# EAGLE design master_brandon (EAGLE 7.1.0)
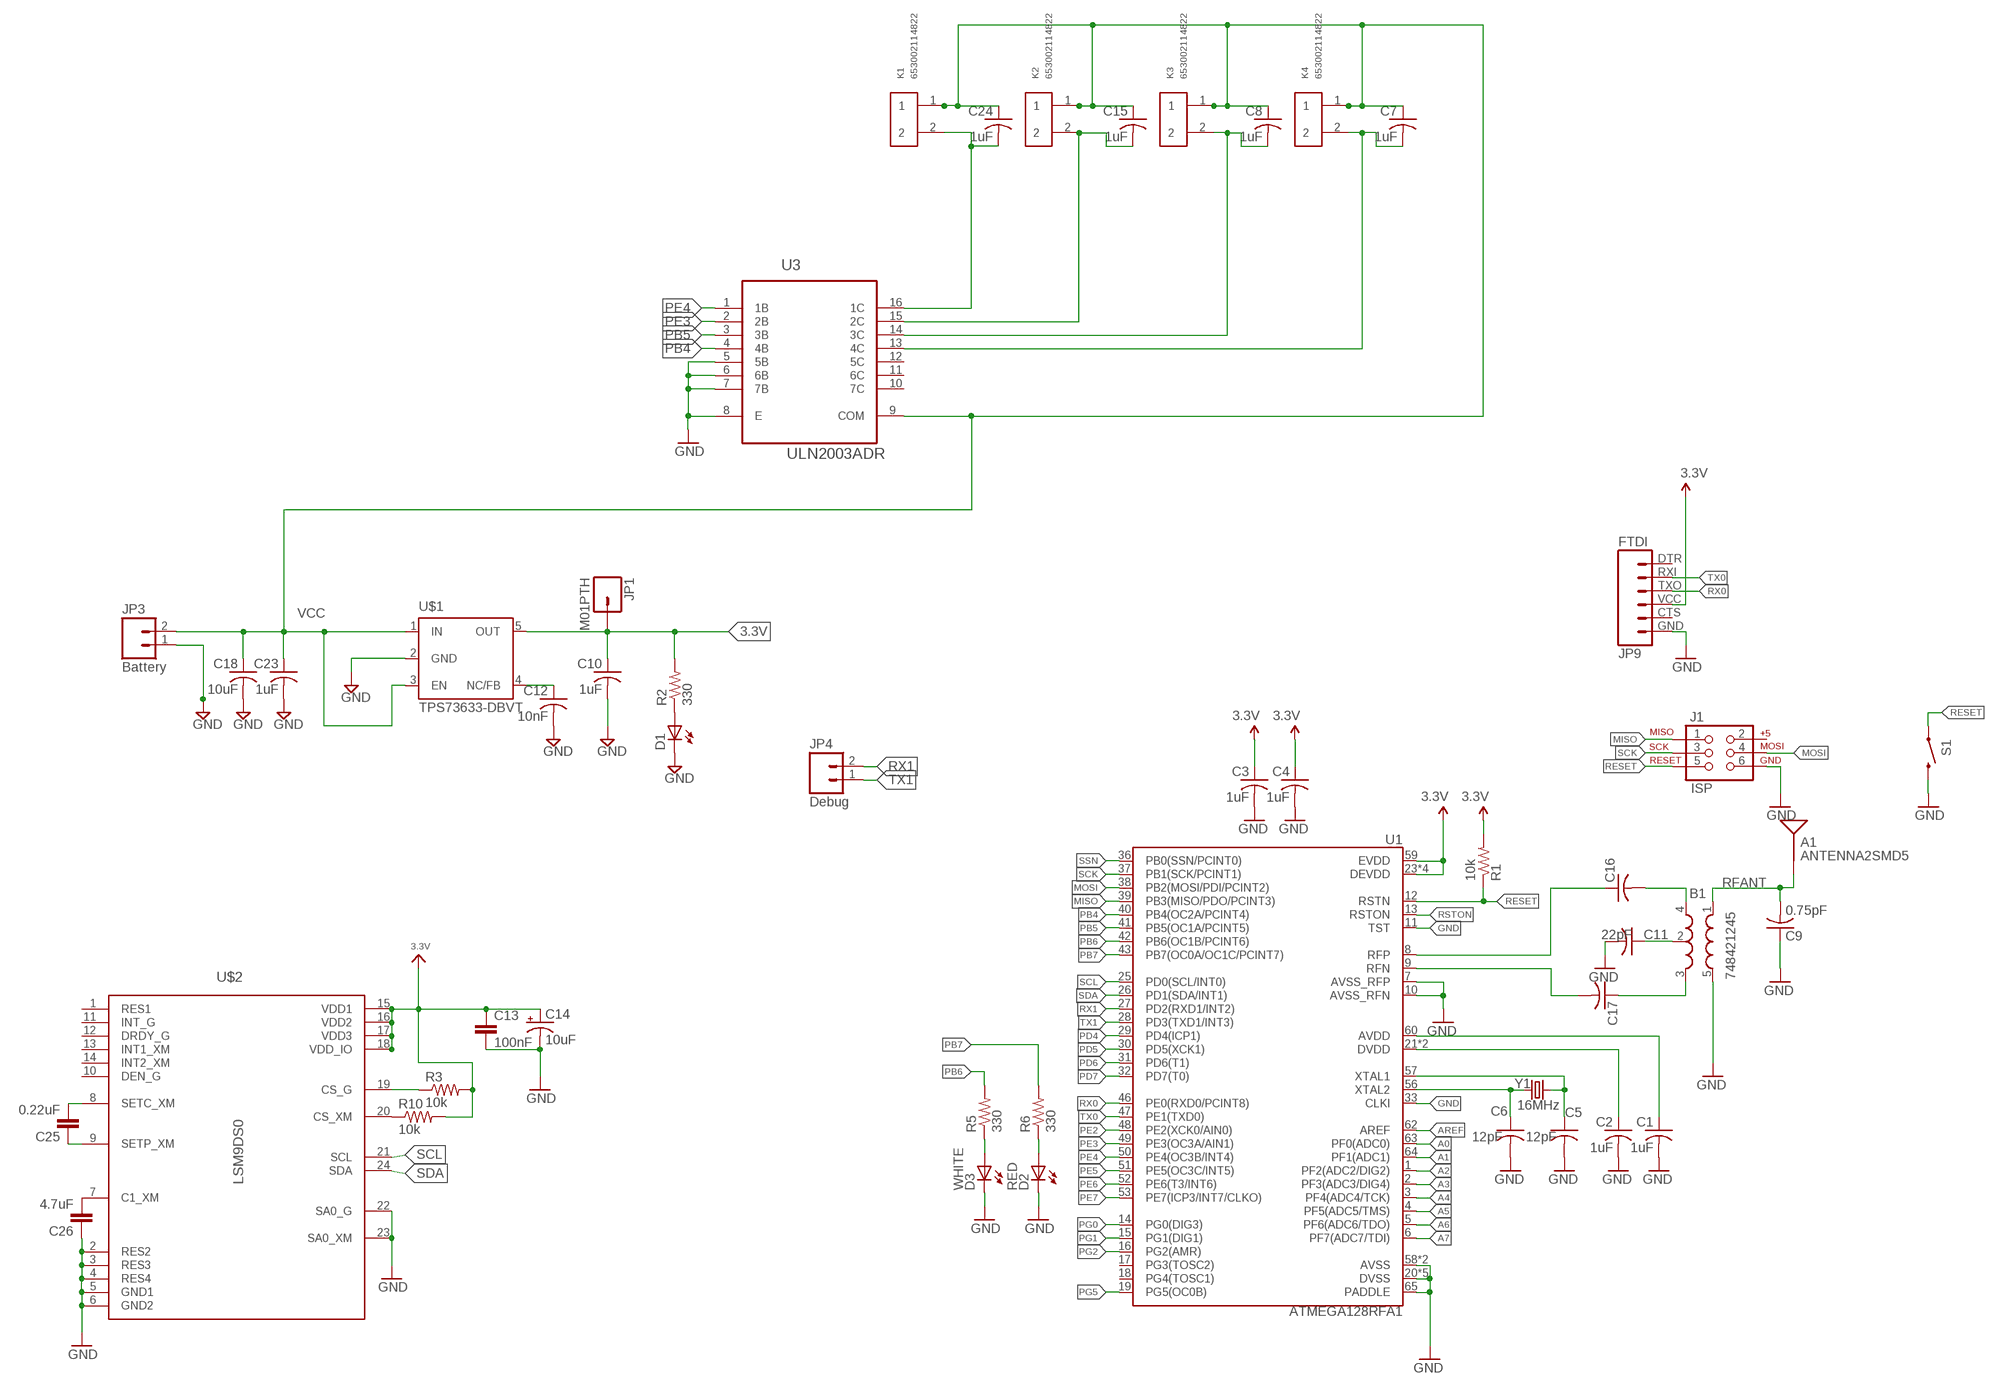
[diagram p0: schematic, sheet 1]

## Parts
A1  ANTENNA2SMD5  [ANTENNA-CHIP5]
B1  748421245  BALUN0805  [BALUN]
C1  1uF  C-USC0805  [C0805]
C2  1uF  C-USC0805  [C0805]
C3  1uF  C-USC0805  [C0805]
C4  1uF  C-USC0805  [C0805]
C5  12pF  C-USC0805  [C0805]
C6  12pF  C-USC0805  [C0805]
C7  1uF  C-USC0805  [C0805]
C8  1uF  C-USC0805  [C0805]
C9  0.75pF  C-USC0805  [C0805]
C10  1uF  C-USC0805  [C0805]
C11  22pF  C-USC0805  [C0805]
C12  10nF  C-USC0805  [C0805]
C13  100nF  CAP0603-CAP  [0603-CAP]
C14  10uF  10UF-20V-10%(TANT)  [EIA3528]
C15  1uF  C-USC0805  [C0805]
C16  C-USC0805  [C0805]
C17  C-USC0805  [C0805]
C18  10uF  C-USC0805  [C0805]
C23  1uF  C-USC0805  [C0805]
C24  1uF  C-USC0805  [C0805]
C25  0.22uF  CAP0603-CAP  [0603-CAP]
C26  4.7uF  CAP0603-CAP  [0603-CAP]
D1  LEDSML0603  [SML0603]
D2  RED  LEDCHIPLED_0603  [CHIPLED_0603]
D3  WHITE  LEDCHIPLED_0603  [CHIPLED_0603]
J1  ISP  AVR_SPI_PRG_6NS  [2X3-NS]
JP1  M01PTH  [1X01]
JP3  Battery  M02PTH  [1X02]
JP4  Debug  M02PTH  [1X02]
JP9  FTDI  FTDI_BASICPTH  [FTDI_BASIC]
K1  653002114822  [653002114822]
K2  653002114822  [653002114822]
K3  653002114822  [653002114822]
K4  653002114822  [653002114822]
R1  10k  R-US_R0805  [R0805]
R2  330  R-US_R0805  [R0805]
R3  10k  RESISTOR0805-RES  [0805]
R5  330  RESISTOR0603-RES  [0603-RES]
R6  330  RESISTOR0603-RES  [0603-RES]
R10  10k  RESISTOR0805-RES  [0805]
S1  SWITCH-MOMENTARY-2SMD  [TACTILE_SWITCH_SMD]
U1  ATMEGA128RFA1  [QFN-64]
U3  ULN2003ADR  [SOIC127P600X175-16N]
U$1  TPS73633-DBVT  [SOT23-DBV]
U$2  LSM9DS0  [LGA-24]
Y1  16MHz  CRYSTAL5X3  [CRYSTAL-SMD-5X3]

## Nets
3.3V: C3.1 C4.1 C10.1 C13.1 C14.A(+) JP1.1 JP9.VCC R1.2 R2.2 R3.2 R10.2 U1.23(DEVDD) U1.34(DEVDD) U1.44(DEVDD) U1.54(DEVDD) U1.59(EVDD) U$1.5(OUT) U$2.15(VDD1) U$2.16(VDD2) U$2.17(VDD3) U$2.18(VDD_IO)
A0: U1.63(PF0(ADC0))
A1: U1.64(PF1(ADC1))
A2: U1.1(PF2(ADC2/DIG2))
A3: U1.2(PF3(ADC3/DIG4))
A4: U1.3(PF4(ADC4/TCK))
A5: U1.4(PF5(ADC5/TMS))
A6: U1.5(PF6(ADC6/TDO))
A7: U1.6(PF7(ADC7/TDI))
AREF: U1.62(AREF)
AVDD: C1.1 U1.60(AVDD)
DVDD: C2.1 U1.21(DVDD) U1.22(DVDD)
GND: B1.5(GND) C1.2 C2.2 C3.2 C4.2 C5.2 C6.2 C9.1 C10.2 C11.2 C12.2 C13.2 C14.C(-) C18.2 C23.2 C26.1 D1.C D2.C D3.C J1.6 JP3.1 JP9.GND S1.3 U1.7(AVSS_RFP) U1.10(AVSS_RFN) U1.11(TST) U1.20(DVSS) U1.24(DVSS) U1.33(CLKI) U1.35(DVSS) U1.45(DVSS) U1.55(DVSS) U1.58(AVSS) U1.61(AVSS) U1.65(PADDLE) U3.5(5B) U3.6(6B) U3.7(7B) U3.8(E) U$1.2(GND) U$2.2(RES2) U$2.3(RES3) U$2.4(RES4) U$2.5(GND1) U$2.6(GND2) U$2.22(SA0_G) U$2.23(SA0_XM)
MISO: J1.1 U1.39(PB3(MISO/PDO/PCINT3))
MOSI: J1.4 U1.38(PB2(MOSI/PDI/PCINT2))
N$1: C12.1 U$1.4(NC/FB)
N$2: D1.A R2.1
N$3: C5.1 U1.57(XTAL1) Y1.3
N$4: C6.1 U1.56(XTAL2) Y1.1
N$5: C26.2 U$2.7(C1_XM)
N$6: C25.2 U$2.8(SETC_XM)
N$7: B1.2(GND) C11.1
N$8: D3.A R5.1
N$9: R10.1 U$2.20(CS_XM)
N$10: B1.4(OUT1) C16.2
N$11: B1.3(OUT2) C17.1
N$13: D2.A R6.1
N$22: C25.1 U$2.9(SETP_XM)
N$23: R3.1 U$2.19(CS_G)
N$24: C15.2 K2.2 U3.15(2C)
N$25: C8.2 K3.2 U3.14(3C)
N$26: C7.2 K4.2 U3.13(4C)
N$29: C24.2 K1.2 U3.16(1C)
PB4: U1.40(PB4(OC2A/PCINT4)) U3.4(4B)
PB5: U1.41(PB5(OC1A/PCINT5)) U3.3(3B)
PB6: R5.2 U1.42(PB6(OC1B/PCINT6))
PB7: R6.2 U1.43(PB7(OC0A/OC1C/PCINT7))
PD4: U1.29(PD4(ICP1))
PD5: U1.30(PD5(XCK1))
PD6: U1.31(PD6(T1))
PD7: U1.32(PD7(T0))
PE2: U1.48(PE2(XCK0/AIN0))
PE3: U1.49(PE3(OC3A/AIN1)) U3.2(2B)
PE4: U1.50(PE4(OC3B/INT4)) U3.1(1B)
PE5: U1.51(PE5(OC3C/INT5))
PE6: U1.52(PE6(T3/INT6))
PE7: U1.53(PE7(ICP3/INT7/CLKO))
PG0: U1.14(PG0(DIG3))
PG1: U1.15(PG1(DIG1))
PG2: U1.16(PG2(AMR))
PG5: U1.19(PG5(OC0B))
RESET: J1.5 R1.1 S1.1 U1.12(RSTN)
RFANT [RFSIG]: A1.FEED(SIGNAL) B1.1(IN) C9.2
RFN: C17.2 U1.9(RFN)
RFP: C16.1 U1.8(RFP)
RSTON: U1.13(RSTON)
RX0: JP9.TXO U1.46(PE0(RXD0/PCINT8))
RX1: JP4.2 U1.27(PD2(RXD1/INT2))
SCK: J1.3 U1.37(PB1(SCK/PCINT1))
SCL: U1.25(PD0(SCL/INT0)) U$2.21(SCL)
SDA: U1.26(PD1(SDA/INT1)) U$2.24(SDA)
SSN: U1.36(PB0(SSN/PCINT0))
TX0: JP9.RXI U1.47(PE1(TXD0))
TX1: JP4.1 U1.28(PD3(TXD1/INT3))
VCC: C7.1 C8.1 C15.1 C18.1 C23.1 C24.1 JP3.2 K1.1 K2.1 K3.1 K4.1 U3.9(COM) U$1.1(IN) U$1.3(EN)
Unconnected: J1.2 JP9.CTS JP9.DTR U1.17(PG3(TOSC2)) U1.18(PG4(TOSC1)) U3.10(7C) U3.11(6C) U3.12(5C) U$2.1(RES1) U$2.10(DEN_G) U$2.11(INT_G) U$2.12(DRDY_G) U$2.13(INT1_XM) U$2.14(INT2_XM)

## Library data of the parts
A1 = SparkFun-RF:ANTENNA2: Chip antenna Single endded antenna. Common with smaller chip antennas. CHIP4 package is the GPS Chip Antenna SKU: GPS-08418. CHIP5 package is 2.4GHz chip antenna SKU: WRL-00144.
B1 = SparkFun-RF:BALUN: 0805 footprint balun- Ember 351/357
C1-C12 C15-C18 C23 C24 = resistor:C-US: CAPACITOR, American symbol
C13 C25 C26 = SparkFun-Capacitors:CAP: Capacitor Standard 0603 ceramic capacitor, and 0.1" leaded capacitor.
C14 = SparkFun-Capacitors:10UF-20V-10%(TANT): CAP-08063; PROD_ID: CAP-08063
D1 = master_devon:LED: LED OSRAM: - CHIPLED LG R971, LG N971, LY N971, LG Q971, LY Q971, LO R971, LY R971 LH N974, LH R974 LS Q976, LO Q976, LY Q976 LO Q996 - Hyper CHIPLED LW Q18S LB Q993, LB Q99A, LB R99A - SideLED LS A670, LO A670, LY A670, LG A670, LP A670 LB A673, LV A673, LT A673, LW A673 LH A674 LY A675 LS A676, LA A676, LO A676, LY A676, LW A676 LS A679, LY A679, LG A679 - Hyper Micro SIDELED® LS Y876, LA Y876, LO Y876, LY Y876 LT Y87S - SmartLED LW L88C, LW L88S LB L89C, LB L89S, LG L890 LS L89K, LO L89K, LY L89K LS L896, LA L896, LO L896, LY L896 - TOPLED LS T670, LO T670, LY T670, LG T670, LP T670 LSG T670, LSP T670, LSY T670, LOP T670, LYG T670 LG T671, LOG T671, LSG T671 LB T673, LV T673, LT T673, LW T673 LH T674 LS T676, LA T676, LO T676, LY T676, LB T676, LH T676, LSB T676, LW T676 LB T67C, LV T67C, LT T67C, LS T67K, LO T67K, LY T67K, LW E67C LS E67B, LA E67B, LO E67B, LY E67B, LB E67C, LV E67C, LT E67C LW T67C LS T679, LY T679, LG T679 LS T770, LO T770, LY T770, LG T770, LP T770 LB T773, LV T773, LT T773, LW T773 LH T774 LS E675, LA E675, LY E675, LS T675 LS T776, LA T776, LO T776, LY T776, LB T776 LHGB T686 LT T68C, LB T68C - Hyper Mini TOPLED® LB M676 - Mini TOPLED Santana® LG M470 LS M47K, LO M47K, LY M47K Source: http://www.osram.convergy.de LUXEON: - LUMILED® LXK2-PW12-R00, LXK2-PW12-S00, LXK2-PW14-U00, LXK2-PW14-V00 LXK2-PM12-R00, LXK2-PM12-S00, LXK2-PM14-U00 LXK2-PE12-Q00, LXK2-PE12-R00, LXK2-PE12-S00, LXK2-PE14-T00, LXK2-PE14-U00 LXK2-PB12-K00, LXK2-PB12-L00, LXK2-PB12-M00, LXK2-PB14-N00, LXK2-PB14-P00, LXK2-PB14-Q00 LXK2-PR12-L00, LXK2-PR12-M00, LXK2-PR14-Q00, LXK2-PR14-R00 LXK2-PD12-Q00, LXK2-PD12-R00, LXK2-PD12-S00 LXK2-PH12-R00, LXK2-PH12-S00 LXK2-PL12-P00, LXK2-PL12-Q00, LXK2-PL12-R00 Source: www.luxeon.com KINGBRIGHT: KA-3528ASYC Source: www.kingbright.com
D2 D3 = led:LED: LED OSRAM: - CHIPLED LG R971, LG N971, LY N971, LG Q971, LY Q971, LO R971, LY R971 LH N974, LH R974 LS Q976, LO Q976, LY Q976 LO Q996 - Hyper CHIPLED LW Q18S LB Q993, LB Q99A, LB R99A - SideLED LS A670, LO A670, LY A670, LG A670, LP A670 LB A673, LV A673, LT A673, LW A673 LH A674 LY A675 LS A676, LA A676, LO A676, LY A676, LW A676 LS A679, LY A679, LG A679 - Hyper Micro SIDELED® LS Y876, LA Y876, LO Y876, LY Y876 LT Y87S - SmartLED LW L88C, LW L88S LB L89C, LB L89S, LG L890 LS L89K, LO L89K, LY L89K LS L896, LA L896, LO L896, LY L896 - TOPLED LS T670, LO T670, LY T670, LG T670, LP T670 LSG T670, LSP T670, LSY T670, LOP T670, LYG T670 LG T671, LOG T671, LSG T671 LB T673, LV T673, LT T673, LW T673 LH T674 LS T676, LA T676, LO T676, LY T676, LB T676, LH T676, LSB T676, LW T676 LB T67C, LV T67C, LT T67C, LS T67K, LO T67K, LY T67K, LW E67C LS E67B, LA E67B, LO E67B, LY E67B, LB E67C, LV E67C, LT E67C LW T67C LS T679, LY T679, LG T679 LS T770, LO T770, LY T770, LG T770, LP T770 LB T773, LV T773, LT T773, LW T773 LH T774 LS E675, LA E675, LY E675, LS T675 LS T776, LA T776, LO T776, LY T776, LB T776 LHGB T686 LT T68C, LB T68C - Hyper Mini TOPLED® LB M676 - Mini TOPLED Santana® LG M470 LS M47K, LO M47K, LY M47K Source: http://www.osram.convergy.de LUXEON: - LUMILED® LXK2-PW12-R00, LXK2-PW12-S00, LXK2-PW14-U00, LXK2-PW14-V00 LXK2-PM12-R00, LXK2-PM12-S00, LXK2-PM14-U00 LXK2-PE12-Q00, LXK2-PE12-R00, LXK2-PE12-S00, LXK2-PE14-T00, LXK2-PE14-U00 LXK2-PB12-K00, LXK2-PB12-L00, LXK2-PB12-M00, LXK2-PB14-N00, LXK2-PB14-P00, LXK2-PB14-Q00 LXK2-PR12-L00, LXK2-PR12-M00, LXK2-PR14-Q00, LXK2-PR14-R00 LXK2-PD12-Q00, LXK2-PD12-R00, LXK2-PD12-S00 LXK2-PH12-R00, LXK2-PH12-S00 LXK2-PL12-P00, LXK2-PL12-Q00, LXK2-PL12-R00 Source: www.luxeon.com KINGBRIGHT: KA-3528ASYC Source: www.kingbright.com
J1 = SparkFun-Connectors:AVR_SPI_PRG_6: AVR ISP 6 Pin This is the reduced ISP connector for AVR programming. Common on Arduino. This footprint will take up less PCB space and can be used with a 10-pin to 6-pin adapter such as SKU: BOB-08508
JP1 = SparkFun:M01: Header 1 Standard 1-pin 0.1" header. Use with straight break away headers (SKU : PRT-00116), right angle break away headers (PRT-00553), swiss pins (PRT-00743), machine pins (PRT-00117), and female headers (PRT-00115).
JP3 JP4 = SparkFun:M02: Header 2 Standard 2-pin 0.1" header. Use with straight break away headers (SKU : PRT-00116), right angle break away headers (PRT-00553), swiss pins (PRT-00743), machine pins (PRT-00117), and female headers (PRT-00115). Molex polarized connector foot print use with SKU : PRT-08233 with associated crimp pins and housings.
JP9 = SparkFun-Connectors:FTDI_BASIC: FTDI Basic header with labels
K1-K4 = Wuerth_Elektronik_eiCan_Wire_to_Board_Connectors:653002114822: WR-WTB 1.25mm Male Vertical Shrouded Header, 2 Pins=>Code : Con_WTB_1.25_PCB_THT_653002114822 <http://katalog.we-online.de/media/thumbs2/eican/thb_Con_WTB_1.25_PCB_THT_6530xx114822_pf2.jpg> Details see: http://katalog.we-online.de/en/em/653_0xx_114_822 Created 2014-06-06, Karrer Zheng 2014 (C) Würth Elektronik; OC_FARNELL: unknown
R1 R2 = resistor:R-US_: RESISTOR, American symbol
R3 R10 = SparkFun-Passives:RESISTOR: Resistor Basic schematic elements and footprints for 0603, 1206, and PTH resistors.
R5 R6 = SparkFun-Resistors:RESISTOR: Resistor Basic schematic elements and footprints for 0603, 1206, and PTH resistors.
S1 = SparkFun-Electromechanical:SWITCH-MOMENTARY-2: Various NO switches- pushbuttons, reed, etc
U1 = master_devon:ATMEGA128RFA1: ATmega128RFA1 8-bit AVR Microcontroller with Low Power 2.4GHz Transceiver for ZigBee and IEEE 802.15.4
U3 = Texas Instruments_By_element14_Batch_1:ULN2003ADR: 8-BIT SHIFT REGISTERS WITH 3-STATE OUTPUT REGISTERS; MPN: ULN2003ADR; OC_FARNELL: 1470513; OC_NEWARK: 77C3560; PACKAGE: SOIC-16; SUPPLIER: TEXAS INSTRUMENTS
U$1 = Power:TPS73633-DBVT
U$2 = IMU_parts:LSM9DS0
Y1 = SparkFun-FreqCtrl:CRYSTAL: Various standard crystals. Proven footprints. Spark Fun Electronics SKU : COM-00534

## Net classes
1 RFSIG: width 0.457 mm, clearance 0.205 mm to class 0, clearance 0.205 mm

## Board
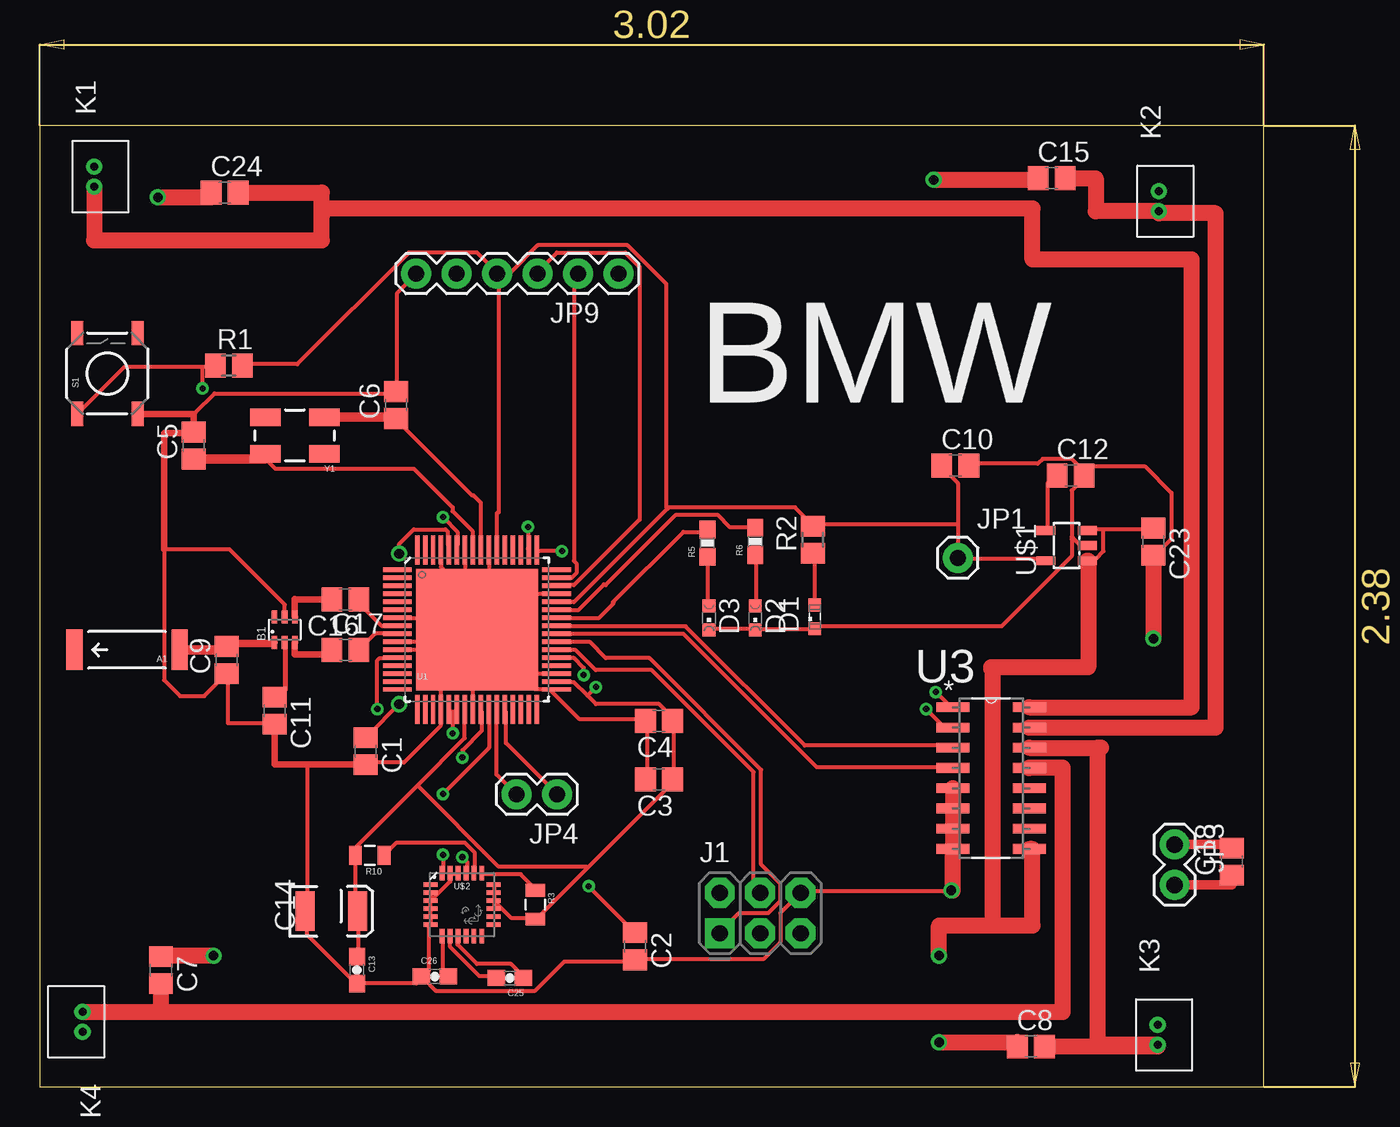
[diagram p1: board, top side]
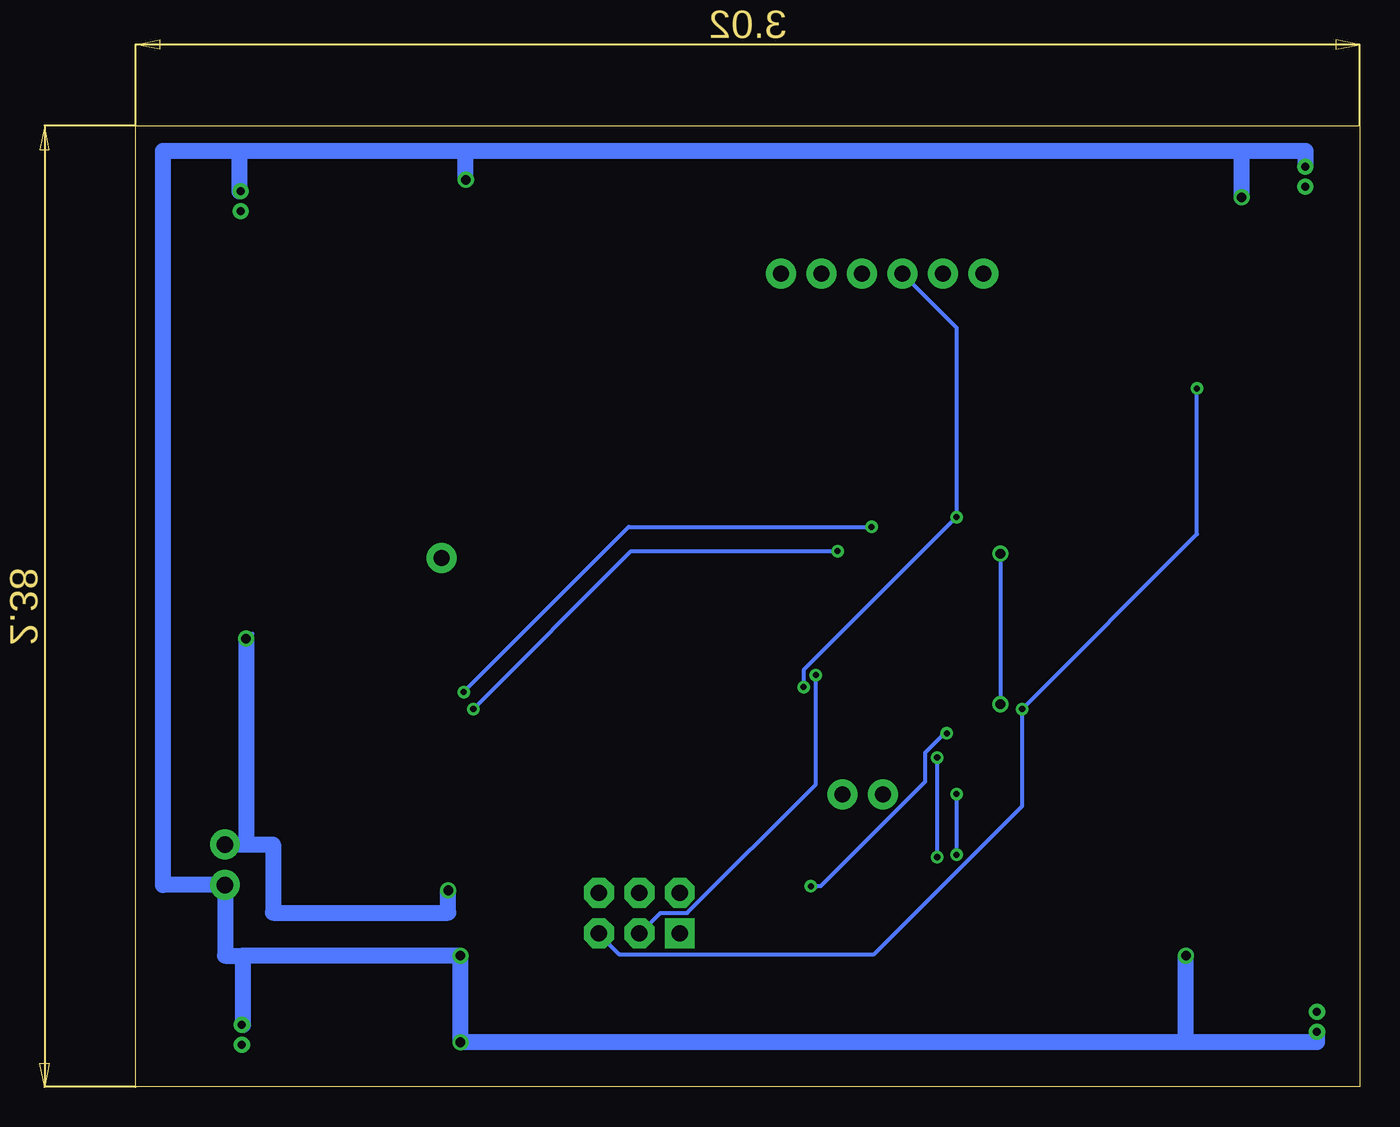
[diagram p2: board, bottom side, seen from below]

Size 76.83 x 60.34 mm. Coordinates in mm from the lower left corner, seen from the top.
Outline: 0,0 76.83,0 76.83,60.34 0,60.34 0,0
Copper layers (1*16): Top 0.035559375mm / dielectric 1.501140625mm / Bottom 0.035559375mm
Design rules "4pcb-33board": minimum track width 10mil, minimum drill 15mil, track to track 6mil, track to pad 6mil, pad to pad 6mil, via to via 6mil, smd to smd 6mil, copper to edge 10mil, drill to drill 10mil, minimum pad ring 10mil, minimum via ring 8mil, stop-mask expansion 4mil, vias tented up to drill 0mil, thermal gap 10mil

### Footprints (pad centres in the part's own frame; a part is rotated, then mirrored left to right if it is on the bottom)
ANTENNA-CHIP5 = smd 1.016 x 2.54: FEED -3.302,0; NC 3.302,0
BALUN = smd 0.35 x 0.8: 1 -0.65,-0.8; 2 0,-0.8; 3 0.65,-0.8; 4 0.65,0.8; 5 0,0.8; 6 -0.65,0.8
C0805 = smd 1.3 x 1.5: 1 -0.85,0; 2 0.85,0
0603-CAP = smd 1.1 x 1: 1 -0.85,0; 2 0.85,0
EIA3528 = smd 1.2 x 2.5: A 1.65,0; C -1.65,0
SML0603 = smd 0.8 x 0.8: A 0.75,0; C -0.75,0
CHIPLED_0603 = smd 0.8 x 0.8: A 0,-0.75; C 0,0.75
2X3-NS = drill 1.016 pad 1.88 square: 1 -2.54,-1.27 | drill 1.016 pad 1.88 octagon: 2 -2.54,1.27; 3 0,-1.27; 4 0,1.27; 5 2.54,-1.27; 6 2.54,1.27
1X01 = drill 1.016 pad 1.88: 1 0,0
1X02 = drill 1.016 pad 1.88: 1 0,0; 2 2.54,0
FTDI_BASIC = drill 1.016 pad 1.88: CTS 10.16,0; DTR 0,0; GND 12.7,0; RXI 2.54,0; TXO 5.08,0; VCC 7.62,0
653002114822 = drill 0.5: 1 0.625,0; 2 -0.625,0
R0805 = smd 1.3 x 1.5: 1 -0.85,0; 2 0.85,0
0805 = smd 0.8 x 1.2: 1 -0.9,0; 2 0.9,0
0603-RES = smd 1.1 x 1: 1 -0.85,0; 2 0.85,0
TACTILE_SWITCH_SMD = smd 1.524 x 0.762: 1 -2.54,1.905; 2 2.54,1.905; 3 -2.54,-1.905; 4 2.54,-1.905
QFN-64 = smd 1.8 x 0.28: 1 -5,3.75; 2 -5,3.25; 3 -5,2.75; 4 -5,2.25; 5 -5,1.75; 6 -5,1.25; 7 -5,0.75; 8 -5,0.25; 9 -5,-0.25; 10 -5,-0.75; 11 -5,-1.25; 12 -5,-1.75; 13 -5,-2.25; 14 -5,-2.75; 15 -5,-3.25; 16 -5,-3.75; 33 5,-3.75; 34 5,-3.25; 35 5,-2.75; 36 5,-2.25; 37 5,-1.75; 38 5,-1.25; 39 5,-0.75; 40 5,-0.25; 41 5,0.25; 42 5,0.75; 43 5,1.25; 44 5,1.75; 45 5,2.25; 46 5,2.75; 47 5,3.25; 48 5,3.75 | smd 0.28 x 1.8: 17 -3.75,-5; 18 -3.25,-5; 19 -2.75,-5; 20 -2.25,-5; 21 -1.75,-5; 22 -1.25,-5; 23 -0.75,-5; 24 -0.25,-5; 25 0.25,-5; 26 0.75,-5; 27 1.25,-5; 28 1.75,-5; 29 2.25,-5; 30 2.75,-5; 31 3.25,-5; 32 3.75,-5; 49 3.75,5; 50 3.25,5; 51 2.75,5; 52 2.25,5; 53 1.75,5; 54 1.25,5; 55 0.75,5; 56 0.25,5; 57 -0.25,5; 58 -0.75,5; 59 -1.25,5; 60 -1.75,5; 61 -2.25,5; 62 -2.75,5; 63 -3.25,5; 64 -3.75,5 | smd 7.65 x 7.65: 65 0,0
SOIC127P600X175-16N = smd 2.057 x 0.61: 1 -4.801,8.89; 2 -4.801,7.62; 3 -4.801,6.35; 4 -4.801,5.08; 5 -4.801,3.81; 6 -4.801,2.54; 7 -4.801,1.27; 8 -4.801,0; 9 0,0; 10 0,1.27; 11 0,2.54; 12 0,3.81; 13 0,5.08; 14 0,6.35; 15 0,7.62; 16 0,8.89
SOT23-DBV = smd 0.55 x 1.2: 1 -0.95,-1.3; 2 0,-1.3; 3 0.95,-1.3; 4 0.95,1.3; 5 -0.95,1.3
LGA-24 = smd 0.9 x 0.29: 1 -1.975,1.25; 2 -1.975,0.75; 3 -1.975,0.25; 4 -1.975,-0.25; 5 -1.975,-0.75; 6 -1.975,-1.25; 13 1.975,-1.25; 14 1.975,-0.75; 15 1.975,-0.25; 16 1.975,0.25; 17 1.975,0.75; 18 1.975,1.25 | smd 0.29 x 0.9: 7 -1.25,-1.975; 8 -0.75,-1.975; 9 -0.25,-1.975; 10 0.25,-1.975; 11 0.75,-1.975; 12 1.25,-1.975; 19 1.25,1.975; 20 0.75,1.975; 21 0.25,1.975; 22 -0.25,1.975; 23 -0.75,1.975; 24 -1.25,1.975
CRYSTAL-SMD-5X3 = smd 1.9 x 1.1: 1 -1.85,-1.15; 2 1.85,-1.15; 3 1.85,1.15; 4 -1.85,1.15

### Placement (x,y rotation side)
A1  5.47,27.43 180 top
B1  15.37,28.7 0 top
C1  20.45,21.08 270 top
C2  37.36,8.83 270 top
C3  38.86,19.3 180 top
C4  38.86,22.99 180 top
C5  9.65,40.26 90 top
C6  22.35,42.8 90 top
C7  7.6,7.34 270 top
C8  62.2,2.54 0 top
C9  11.72,26.8 90 top
C10  57.46,39 0 top
C11  14.73,23.62 270 top
C12  64.7,38.39 0 top
C13  19.9,7.34 270 top
C14  18.3,11.04 0 top
C15  63.5,57.04 0 top
C16  19.18,30.61 180 top
C17  19.18,27.43 0 top
C18  74.8,14.14 90 top
C23  69.88,34.23 270 top
C24  11.6,56.14 0 top
C25  29.5,6.84 180 top
C26  24.8,6.94 0 top
D1  48.64,29.51 90 top
D2  44.9,29.44 180 top
D3  42,29.44 180 top
J1  45.21,10.92 0 top
JP1  57.61,33.2 0 top
JP3  71.22,15.21 270 top
JP4  32.47,18.37 180 top
JP9  36.32,51.05 180 top
K1  3.4,57.14 90 top
K2  70.24,55.59 90 top
K3  70.15,3.27 90 top
K4  2.68,4.09 270 top
R1  11.86,45.28 0 top
R2  48.51,34.35 90 top
R3  31.1,11.44 270 top
R5  41.9,34.14 90 top
R6  44.9,34.24 90 top
R10  20.7,14.54 180 top
S1  4.24,44.78 90 top
U1  27.43,28.7 0 top
U3  62.1,14.94 0 top
U$1  64.44,33.98 90 top
U$2  26.5,11.44 0 top
Y1  16,40.89 180 top

### Tracks (layer width: path | path; a pad name or v marks a point on that pad's centre or on a via)
3.3V  (via drill 0.38)
  Top 0.254: U1.54 28.68,36.02 | 28.68,36.02 28.7,36.04 | 26.18,34.26 U1.59 26.21,34.24 26.21,34.85 v25.3,35.76 | R1.2 12.8,45.36 16.15,45.36 23.16,52.38 27.43,52.38 28.65,51.16 JP9.VCC | 28.68,36.02 28.8,36.07 28.8,51 JP9.VCC | U$1.5 63.09,33.17 57.76,33.17 JP1.1 57.61,33.33 57.61,35.31 | 57.61,35.31 57.61,37.9 56.54,38.96 C10.1 | C13.1 19.96,8.33 19.96,10.92 C14.A 19.81,11.07 19.81,14.43 R10.2 19.81,14.58 19.81,15.04 23.7,18.92 | 23.7,18.92 26.67,21.89 26.67,23.57 U1.23 | 28.5,11.68 28.5,11.23 U$2.15 | U$2.18 28.5,12.6 28.5,12.29 U$2.17 28.5,12.14 28.5,11.68 | 28.5,11.68 29.57,10.62 31.09,10.62 R3.2 31.24,10.62 34.37,13.74 | 28.5,11.68 U$2.16 | 34.37,24.56 34.9,24.03 38.86,24.03 39.78,23.11 C4.1 39.78,22.96 39.78,19.3 C3.1 39.62,19.3 39.62,19 34.37,13.74 | 34.37,24.56 33.53,25.4 32.46,25.4 U1.34 | 23.7,18.92 28.8,13.82 34.29,13.82 34.37,13.74 | 57.61,35.31 48.62,35.31 R2.2 48.46,35.31 47.4,36.37 39.47,36.37 39.4,36.3 | 39.4,36.3 33.53,30.43 32.46,30.43 U1.44 | JP9.VCC 28.8,51.16 29.57,51.16 31.24,52.83 36.88,52.83 39.32,50.39 39.32,36.37 39.4,36.3 | v34.9,25.09 34.37,24.56
  Bottom 0.254: JP9.VCC 25.3,47.65 v25.3,35.76 34.9,26.16 v34.9,25.09
AVDD  (via drill 0.61)
  Top 0.254: 25.68,34.06 U1.60 25.6,34.09 25.6,34.85 25.45,35 23.47,35 22.55,34.09 v22.55,33.48 | v22.55,24.03 20.57,22.05 C1.1
  Bottom 0.254: v22.55,33.48 v22.55,24.03
DVDD  (via drill 0.38)
  Top 0.254: v34.44,12.6 37.34,9.7 C2.1 | v25.91,22.2 25.91,23.42 25.83,23.49 | 25.83,23.49 25.76,23.57 U1.21 | U1.22 26.06,23.57 25.91,23.57 25.83,23.49
  Bottom 0.254: v34.44,12.6 33.83,12.6 27.28,19.15 27.28,20.98 26.06,22.2 v25.91,22.2
GND  (via drill 0.6)
  Top 0.254: 30.9,25.94 31,25.84 31,25.04 31.09,24.95 U1.33 32,24.94 33.83,23.11 37.95,23.11 C4.2 38.1,22.96 38.1,19.3 C3.2 37.95,19.3 | 30.9,25.94 31.92,25.94 U1.35 | U1.24 27.18,25.04 | U1.20 25.18,25.02 | 25.18,25.02 25.2,25.04 | 27.2,25.94 27.2,28.7 U1.65 27.89,29.15 | 27.2,25.94 27.2,25.14 27.18,25.12 27.18,25.04 | 30.9,25.94 27.2,25.94 | 25.2,25.04 25.2,25.02 25.18,25.02 | 25.2,25.04 27.18,25.04 | 25.2,25.04 25.2,27.44 24.2,27.44 | 24.2,27.44 22.93,27.44 U1.11 | U1.55 28.18,30.94 | 28.18,30.94 28.18,29.45 27.89,29.15 | U1.45 28.19,30.95 28.18,30.94 | U1.58 26.68,31.14 | 26.68,31.14 26.68,30.36 27.89,29.15 | U1.61 25.18,32.64 26.68,31.14 | U1.61 25.18,29.92 24.71,29.45 U1.7 | U1.10 23.69,27.95 24.2,27.44 | U1.61 25.18,33.66 | C11.2 14.73,22.84 11.8,22.84 11.8,25.95 C9.1 10.31,24.54 8.8,24.54 7.8,25.54 7.8,33.74 11.9,33.74 15.37,30.27 B1.5 | JP9.GND 23.62,51 22.4,49.78 22.4,43.69 C6.2 22.25,43.54 10.97,43.54 9.75,42.32 9.65,42.24 | 64.85,34.47 64.77,34.54 64.77,37.44 65.68,38.35 C12.2 65.23,38.96 | 64.85,34.47 65.23,34.09 65.68,34.09 U$1.2 | 65.23,38.96 69.34,38.96 71.02,37.29 71.02,34.39 70.26,33.63 C23.2 | 25.15,23.72 25.15,24.18 U1.20 | 25.76,13.36 26.21,13.36 U$2.22 | 24.54,11.68 24.54,12.14 U$2.2 | 24.54,11.68 24.54,11.23 U$2.4 24.54,11.07 24.54,10.77 U$2.5 24.54,10.62 24.54,10.31 U$2.6 24.38,10.16 24.38,7.26 | 25.76,13.36 25.76,12.9 24.54,11.68 | 25.76,13.36 U$2.23 | 24.54,11.68 U$2.3 | 23.62,6.5 23.93,6.81 C26.1 | 24.38,7.26 24.08,6.96 C26.1 | D3.C 42.06,28.75 44.81,28.75 D2.C 44.96,28.75 48.62,28.75 D1.C 48.77,28.9 60.35,28.9 64.77,33.33 64.77,34.39 64.85,34.47 | 65.23,38.96 64.77,39.42 62.94,39.42 62.64,39.12 58.37,39.12 C10.2
  Top 0.254: v57.2,12.34 56.69,12.29 47.85,12.29 J1.6 46.48,10.92 46.48,9.09 45.41,8.03 37.49,8.03 C2.2 37.34,7.87 32.92,7.87 31.09,6.04 24.84,6.04 24.08,6.81 C26.1 | 23.62,6.5 19.96,6.5 C13.2 19.81,6.5 16.76,9.55 16.76,10.92 C14.C 16.76,11.07 16.76,20.23 | 23.62,6.5 C26.1 | 24.38,7.26 C26.1 | C1.2 20.57,20.37 22.86,20.37 25.15,22.66 25.15,23.57 U1.20
  Top 0.406: C11.2 14.73,20.23 16.76,20.23 C1.2 16.8,20.23 | 7.8,33.74 7.8,41.04 9.65,41.04 C5.2 9.65,42.24 S1.3
  Top 0.61: C18.2 74.8,15.21 JP3.1
  Top 1.016: U3.5 U3.6 U3.7 U3.8 57.3,12.34 v57.2,12.34 | C23.2 69.9,33.38 v69.9,28.14
  Bottom 0.254: 69.49,28.45 v69.9,28.14
  Bottom 1.016: JP3.1 69.9,15.21 | 69.9,15.21 68.2,15.21 68.2,10.94 57.2,10.94 v57.2,12.34 | v69.9,28.14 69.9,15.21
MISO
  Top 0.254: U1.39 34.49,27.95 35.5,26.94 35.51,26.92 38.25,26.92 45.26,19.91 45.26,13.97 46.48,12.75 46.48,11.68 45.72,10.92 43.89,10.92 42.67,9.7 J1.1
MOSI
  Top 0.254: U1.38 33.59,27.45 34.8,26.24 34.9,26.16 38.41,26.16 44.81,19.76 44.81,12.6 J1.4
N$1
  Top 0.254: U$1.4 63.25,35 63.25,37.9 63.7,38.35 C12.1
N$2
  Top 0.254: D1.A 48.62,30.28 48.62,33.48 R2.1
N$3
  Top 0.254: U1.57 27.18,34.86 25.9,36.14 25.91,36.22 25.91,36.37 23.47,38.81 14.78,38.81 14.33,39.27 Y1.3
  Top 0.61: C5.1 14.15,39.41 Y1.3
N$4
  Top 0.254: U1.56 27.68,36.66 27.2,37.14 27.13,37.13 22.4,41.86 C6.1
  Top 0.61: Y1.1 22.35,42.04 C6.1
N$5
  Top 0.254: U$2.7 25.3,9.4 25.3,7.26 25.6,6.96 C26.2
N$6
  Top 0.254: U$2.8 25.76,9.4 25.76,8.79 27.58,6.96 28.5,6.96 C25.2
N$7
  Top 0.305: B1.2 15.4,27.9 15.4,24.94 14.73,24.94 C11.1
N$8
  Top 0.254: D3.A 41.91,30.28 41.91,33.17 R5.1
N$9
  Top 0.254: U$2.20 27.28,13.51 27.28,14.73 26.67,15.34 22.4,15.34 21.64,14.58 R10.1
N$10
  Top 0.406: B1.4 16,29.52 16,30.64 16.03,30.61 C16.2
N$11
  Top 0.406: B1.3 16,27.88 16,27.14 18.33,27.14 C17.1
N$13
  Top 0.254: D2.A 44.96,30.28 44.96,33.33 R6.1
N$22
  Top 0.254: U$2.9 26.21,9.4 26.21,8.94 27.43,7.72 29.57,7.72 30.33,6.96 C25.1
N$23
  Top 0.254: U$2.19 27.89,13.36 30.18,13.36 31.09,12.45 R3.1
N$24
  Top 1.016: U3.15 73.8,22.56 73.8,54.84 70.24,54.84 K2.2 66.28,54.97 66.28,57.04 C15.2
N$25
  Top 1.016: U3.14 66.4,21.29 | 66.4,21.29 66.6,21.29 | 70.15,2.6 K3.2 | C8.2 70.15,2.54 K3.2 | K3.2 66.4,2.64 66.4,21.29
N$26
  Top 1.016: K4.2 7.6,4.71 | 7.6,4.71 64.2,4.71 64.2,20.04 62.1,20.04 U3.13 | C7.2 7.6,4.71
N$29
  Top 0.254: 17.7,54.66 17.68,54.66 17.73,55.14
  Top 1.016: K1.2 3.4,53.14 17.7,53.14 17.7,54.66 17.7,56.14 C24.2 | 17.73,55.14 62.3,55.14 62.3,51.94 72.3,51.94 72.3,23.83 U3.16
PB4
  Top 0.254: U1.40 32.46,28.45 40.39,28.45 48.77,20.07 57.15,20.07 U3.4
PB5
  Top 0.254: U1.41 32.46,28.9 40.54,28.9 48.01,21.44 57.15,21.44 U3.3
PB6
  Top 0.254: U1.42 35.11,29.45 36,30.34 35.97,30.43 40.39,34.85 41.76,34.85 R5.2
PB7
  Top 0.254: U1.43 33.81,29.95 35.4,31.54 35.51,31.5 39.93,35.92 42.52,35.92 43.28,35.15 44.81,35.15 R6.2
PE3  (via drill 0.38)
  Top 0.254: v32.77,33.63 31.24,33.63 U1.49 | v55.63,23.72 56.69,22.66 57.15,22.66 U3.2
  Bottom 0.254: v32.77,33.63 45.72,33.63 v55.63,23.72
PE4  (via drill 0.38)
  Top 0.254: v30.63,35.15 30.63,33.78 U1.50 | v56.24,24.79 57.15,23.88 U3.1
  Bottom 0.254: v30.63,35.15 45.87,35.15 v56.24,24.79
RESET  (via drill 0.38)
  Top 0.254: 10.21,45.21 5.33,45.21 2.44,42.32 S1.1 | 10.21,45.21 10.97,45.21 R1.1 | v21.18,23.72 21.18,26.77 21.34,26.92 22.4,26.92 U1.12 | v10.21,43.84 10.21,45.21
  Bottom 0.254: J1.5 47.7,9.55 46.48,8.33 30.48,8.33 21.18,17.63 v21.18,23.72 10.21,34.7 v10.21,43.84
RFANT
  Top 0.457: B1.1 14.63,27.84 11.89,27.84 C9.2
  Top 0.61: A1.FEED 11.72,27.43 C9.2
RFN
  Top 0.254: U1.9 21.05,28.45 C17.2
RFP
  Top 0.254: 21.68,28.95 U1.8 21.64,28.9 21.49,28.9 20.12,30.28 20.12,30.58 C16.1
RX0
  Top 0.254: 32.61,31.5 32,31.5 U1.46 32.61,31.5 | JP9.TXO 31.24,51.16 32.46,52.38 36.73,52.38 37.64,51.46 37.64,35.61 33.53,31.5 32.61,31.5
RX1
  Top 0.254: U1.27 28.65,23.57 28.65,19.61 29.87,18.39 JP4.2
SCK  (via drill 0.38)
  Top 0.254: v34.14,25.86 34.14,26.31 33.53,26.92 32.46,26.92 U1.37
  Bottom 0.254: v34.14,25.86 34.14,19 42.22,10.92 43.89,10.92 45.11,9.7 J1.3
SCL  (via drill 0.38)
  Top 0.254: v26.52,14.43 26.82,14.12 26.82,13.51 U$2.21 | v26.52,20.68 26.52,21.13 27.74,22.35 27.74,23.57 U1.25
  Bottom 0.254: v26.52,20.68 v26.52,14.43
SDA  (via drill 0.38)
  Top 0.254: v25.3,14.58 25.3,13.51 U$2.24 | v25.3,18.39 28.19,21.29 28.19,23.57 U1.26
  Bottom 0.254: v25.3,18.39 v25.3,14.58
TX0
  Top 0.254: 32.46,31.95 32,31.95 U1.47 32.46,31.95 | JP9.RXI 33.68,51 33.53,50.85 33.53,33.02 33.68,32.87 33.68,32.26 33.38,31.95 32.46,31.95
TX1
  Top 0.254: U1.28 29.26,23.57 29.26,21.59 32.46,18.39 JP4.1
VCC  (via drill 0.6)
  Top 0.254: 66.75,35 69.8,35 C23.1 | 66.75,35 65.84,35 U$1.3 | 66.75,35 66.75,33.63 66.29,33.17 U$1.1
  Top 0.61: C18.1 74.8,12.67 JP3.2
  Top 1.016: v56.44,8.24 56.44,10.14 59.8,10.14 | 59.8,10.14 62.3,10.14 62.3,14.94 U3.9 | U$1.1 65.8,33.03 65.8,26.34 59.7,26.34 59.7,26.24 59.8,26.24 59.8,10.14 | v10.9,8.24 7.6,8.24 C7.1 | v56.44,2.81 61.35,2.81 C8.1 | v56.1,56.94 62.65,56.94 C15.1 | v7.4,55.84 10.75,55.84 C24.1
  Bottom 1.016: K1.1 3.4,58.74 7.4,58.74 | 7.4,58.74 56.1,58.74 | 56.1,58.74 70.3,58.74 | 70.3,58.74 75.1,58.74 75.1,12.67 JP3.2 71.22,8.24 70.1,8.24 | K2.1 70.3,56.22 70.3,58.74 | v56.1,56.94 56.1,58.74 | v7.4,55.84 7.4,58.74 | K4.1 2.68,2.81 10.9,2.81 | 70.1,8.24 v56.44,8.24 v56.44,2.81 10.9,2.81 | 70.1,8.24 70.1,3.89 K3.1 | 10.9,2.81 v10.9,8.24

### Text on the board
tPlace: BMW